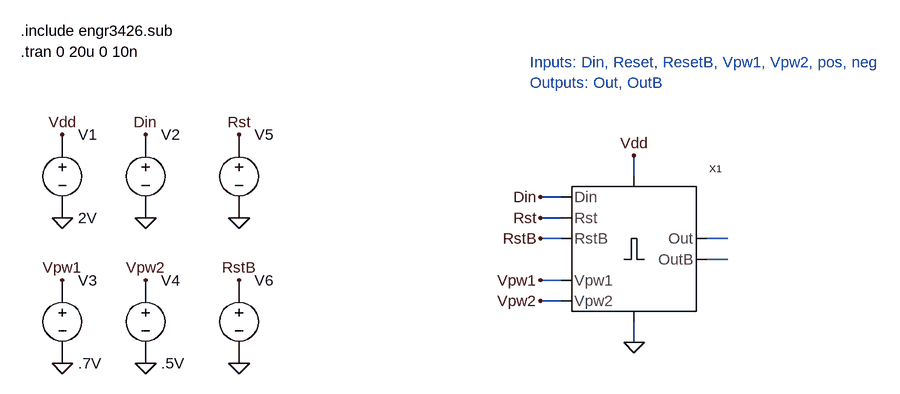
[diagram p0: schematic pulse_width_control_test.asc]
pulse_width_control_test.asc, the LTspice schematic file:
Version 4
SHEET 1 2604 1100
WIRE 320 144 320 112
WIRE 208 176 176 176
WIRE 208 208 176 208
WIRE 208 240 176 240
WIRE 464 240 432 240
WIRE 464 272 432 272
WIRE 208 304 176 304
WIRE 208 336 176 336
WIRE 320 400 320 368
FLAG 320 112 Vdd
FLAG 320 400 0
FLAG 176 176 Din
FLAG 176 208 Rst
FLAG 176 240 RstB
FLAG 176 304 Vpw1
FLAG 176 336 Vpw2
FLAG -560 80 Vdd
FLAG -560 208 0
FLAG -432 80 Din
FLAG -432 208 0
FLAG -560 432 0
FLAG -432 432 0
FLAG -560 304 Vpw1
FLAG -432 304 Vpw2
FLAG -288 208 0
FLAG -288 80 Rst
FLAG -288 432 0
FLAG -288 304 RstB
SYMBOL pulse_width_control 320 256 R0
SYMATTR InstName X1
SYMATTR SpiceLine A=0.2u
SYMBOL cktsym\\vsource -560 144 R0
WINDOW 123 0 0 Left 2
WINDOW 39 0 0 Left 2
SYMATTR Value 2V
SYMATTR InstName V1
SYMBOL cktsym\\vsource -432 144 R0
WINDOW 3 48 16 Invisible 2
WINDOW 123 0 0 Left 2
WINDOW 39 0 0 Left 2
SYMATTR Value PWL(0u 0 12u 0 12.01u 2 12.15u 2 12.16u 0 20u 0)
SYMATTR InstName V2
SYMBOL cktsym\\vsource -560 368 R0
WINDOW 123 0 0 Left 2
WINDOW 39 0 0 Left 2
SYMATTR Value .7V
SYMATTR InstName V3
SYMBOL cktsym\\vsource -432 368 R0
WINDOW 123 0 0 Left 2
WINDOW 39 0 0 Left 2
SYMATTR Value .5V
SYMATTR InstName V4
SYMBOL cktsym\\vsource -288 144 R0
WINDOW 3 48 16 Invisible 2
WINDOW 123 0 0 Left 2
WINDOW 39 0 0 Left 2
SYMATTR Value 0
SYMATTR InstName V5
SYMBOL cktsym\\vsource -288 368 R0
WINDOW 3 48 16 Invisible 2
WINDOW 123 0 0 Left 2
WINDOW 39 0 0 Left 2
SYMATTR Value 2
SYMATTR InstName V6
TEXT -624 -80 Left 2 !.include engr3426.sub
TEXT -624 -48 Left 2 !.tran 0 20u 0 10n
TEXT 160 -32 Left 2 ;Inputs: Din, Reset, ResetB, Vpw1, Vpw2, pos, neg
TEXT 160 0 Left 2 ;Outputs: Out, OutB

The netlist it stands for:
* pulse_width_control_test.asc
XX1 Din Rst RstB Vpw1 Vpw2 Vdd 0 N001 N002 pulse_width_control A=0.2u  ; pins Din Reset ResetB Vpw1 Vpw2 pos neg Out OutB
V1 Vdd 0 2V
V2 Din 0 PWL(0u 0 12u 0 12.01u 2 12.15u 2 12.16u 0 20u 0)
V3 Vpw1 0 .7V
V4 Vpw2 0 .5V
V5 Rst 0 0
V6 RstB 0 2
.include engr3426.sub
.tran 0 20u 0 10n
* Inputs: Din, Reset, ResetB, Vpw1, Vpw2, pos, neg
* Outputs: Out, OutB
.backanno
.end